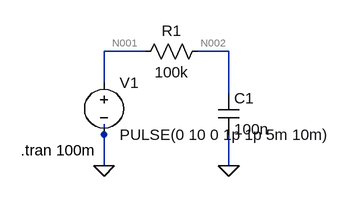
[diagram p0: schematic EC LAB1.asc]
EC LAB1.asc, the LTspice schematic file:
Version 4
SHEET 1 880 680
WIRE 128 80 64 80
WIRE 256 80 208 80
WIRE 64 128 64 80
WIRE 256 144 256 80
WIRE 64 208 64 192
WIRE 64 256 64 208
WIRE 256 256 256 208
FLAG 64 256 0
FLAG 256 256 0
SYMBOL voltage 64 112 R0
WINDOW 123 0 0 Left 0
WINDOW 39 0 0 Left 0
SYMATTR InstName V1
SYMATTR Value PULSE(0 10 0 1p 1p 5m 10m)
SYMBOL res 224 64 R90
WINDOW 0 0 56 VBottom 2
WINDOW 3 32 56 VTop 2
SYMATTR InstName R1
SYMATTR Value 100k
SYMBOL cap 240 144 R0
SYMATTR InstName C1
SYMATTR Value 100n
TEXT -64 232 Left 2 !.tran 100m

The netlist it stands for:
* EC LAB1.asc
V1 N001 0 PULSE(0 10 0 1p 1p 5m 10m)
R1 N002 N001 100k
C1 N002 0 100n
.tran 100m
.backanno
.end

* Results of the author's LTspice run, read from the files saved beside the schematic
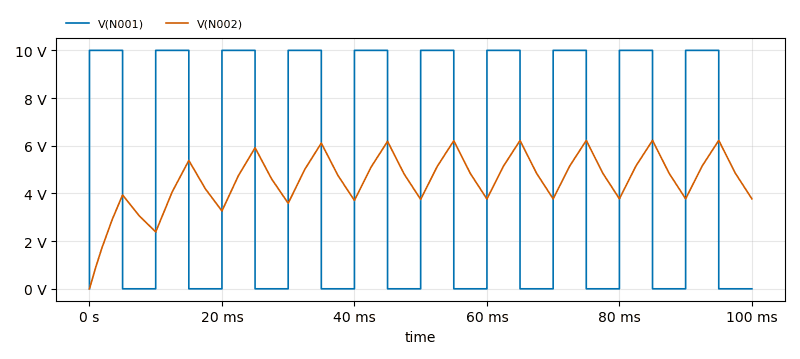
[diagram p1: Transient Analysis of EC LAB1.asc, plotted from the saved traces]
* Transient Analysis, 1 run:
*   V(N001): min 0 V, max 10 V, average 5 V, rms 7.071 V, last 0 V
*   V(N002): min 0 V, max 6.224 V, average 4.622 V, rms 4.763 V, last 3.775 V